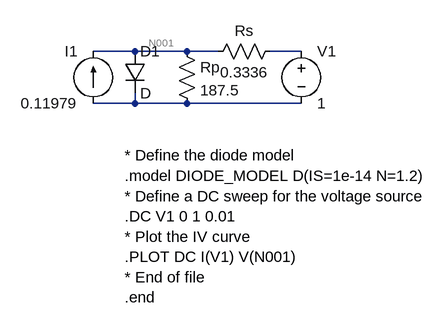
[diagram p0: schematic Circuit Schematic.asc]
Circuit Schematic.asc, the LTspice schematic file:
Version 4.1
SHEET 1 880 680
WIRE 16 112 -48 112
WIRE 96 112 16 112
WIRE 144 112 96 112
WIRE 272 112 224 112
WIRE 16 192 16 176
WIRE 16 192 -48 192
WIRE 96 192 16 192
WIRE 272 192 96 192
SYMBOL voltage 272 96 R0
SYMATTR InstName V1
SYMATTR Value 1
SYMBOL res 240 96 R90
WINDOW 0 0 56 VBottom 2
WINDOW 3 32 56 VTop 2
SYMATTR InstName Rs
SYMATTR Value 0.3336
SYMBOL res 80 96 R0
SYMATTR InstName Rp
SYMATTR Value 187.5
SYMBOL diode 0 112 R0
SYMATTR InstName D1
SYMBOL current -48 192 R180
WINDOW 0 24 80 Left 2
WINDOW 3 24 0 Left 2
SYMATTR InstName I1
SYMATTR Value 0.11979
TEXT 0 272 Left 2 !* Define the diode model\n.model DIODE_MODEL D(IS=1e-14 N=1.2)\n* Define a DC sweep for the voltage source\n.DC V1 0 1 0.01\n* Plot the IV curve\n.PLOT DC I(V1) V(N001)\n* End of file\n.end

The netlist it stands for:
* Circuit Schematic.asc
V1 N002 N003 1
Rs N002 N001 0.3336
Rp N001 N003 187.5
D1 N001 N003 D
I1 N003 N001 0.11979
.model D D
.lib standard.dio
* Define the diode model
.model DIODE_MODEL D(IS=1e-14 N=1.2)
* Define a DC sweep for the voltage source
.DC V1 0 1 0.01
* Plot the IV curve
.PLOT DC I(V1) V(N001)
* End of file
.end
.backanno
.end